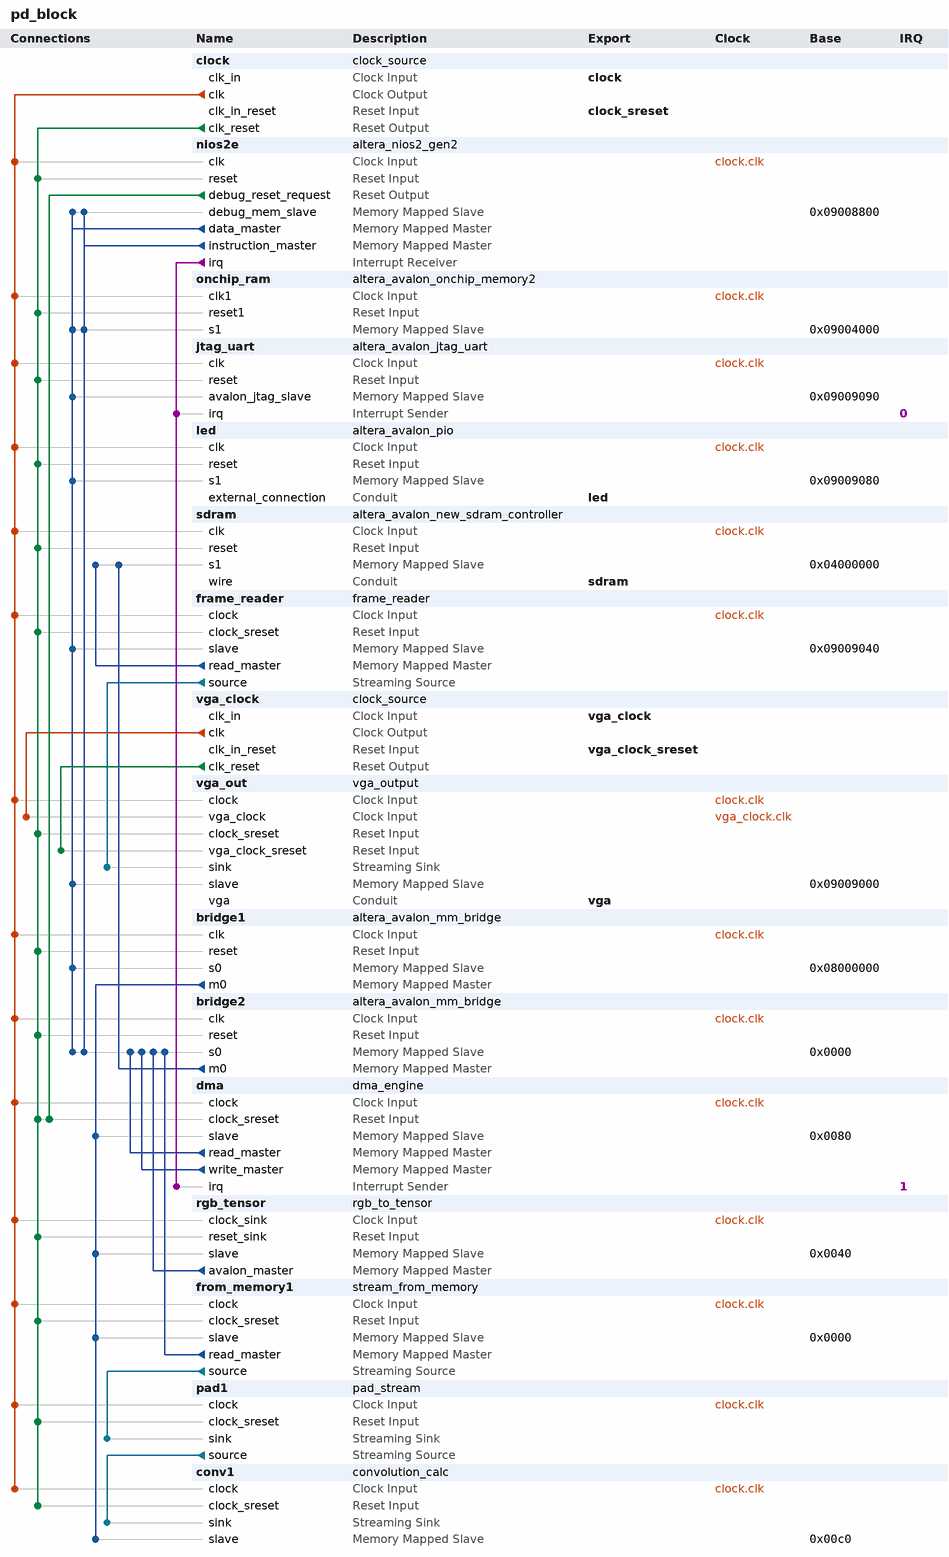
[diagram p0: system contents]
# Platform Designer (Qsys) system pd_block, MAX 10 10M50DAF484C7G
# Parameters at their usual value, and those the tool derives, are not listed.
package require -exact qsys 18.1
create_system pd_block
set_project_property DEVICE_FAMILY {MAX 10}
set_project_property DEVICE 10M50DAF484C7G

add_instance clock clock_source 18.1
set_instance_parameter_value clock clockFrequency 100000000
set_instance_parameter_value clock resetSynchronousEdges BOTH

add_instance nios2e altera_nios2_gen2 18.1
set_instance_parameter_value nios2e dcache_size 2048
set_instance_parameter_value nios2e exceptionSlave onchip_ram.s1
set_instance_parameter_value nios2e icache_size 4096
set_instance_parameter_value nios2e impl Tiny
set_instance_parameter_value nios2e resetSlave onchip_ram.s1

add_instance onchip_ram altera_avalon_onchip_memory2 18.1
set_instance_parameter_value onchip_ram dataWidth 32
set_instance_parameter_value onchip_ram dualPort false
set_instance_parameter_value onchip_ram initMemContent true
set_instance_parameter_value onchip_ram initializationFileName onchip_mem.hex
set_instance_parameter_value onchip_ram memorySize 16384

add_instance jtag_uart altera_avalon_jtag_uart 18.1
set_instance_parameter_value jtag_uart simInteractiveOptions NO_INTERACTIVE_WINDOWS

add_instance led altera_avalon_pio 18.1
set_instance_parameter_value led direction Output
set_instance_parameter_value led width 10

add_instance sdram altera_avalon_new_sdram_controller 18.1
set_instance_parameter_value sdram TAC 5.5
set_instance_parameter_value sdram TRCD 20.0
set_instance_parameter_value sdram TRP 20.0
set_instance_parameter_value sdram casLatency 2
set_instance_parameter_value sdram columnWidth 10
set_instance_parameter_value sdram dataWidth 16
set_instance_parameter_value sdram generateSimulationModel false
set_instance_parameter_value sdram model single_Micron_MT48LC4M32B2_7_chip
set_instance_parameter_value sdram numberOfBanks 4
set_instance_parameter_value sdram numberOfChipSelects 1
set_instance_parameter_value sdram powerUpDelay 100.0
set_instance_parameter_value sdram refreshPeriod 7.8125
set_instance_parameter_value sdram rowWidth 13

add_instance frame_reader frame_reader 1.0
set_instance_parameter_value frame_reader XRES 640
set_instance_parameter_value frame_reader YRES 480

add_instance vga_clock clock_source 18.1
set_instance_parameter_value vga_clock clockFrequency 25000000
set_instance_parameter_value vga_clock resetSynchronousEdges BOTH

add_instance vga_out vga_output 1.0
set_instance_parameter_value vga_out FIFO_DEPTH 1024
set_instance_parameter_value vga_out NO_SIGNAL_RGB 65280
set_instance_parameter_value vga_out VGA_HBPORCH 48
set_instance_parameter_value vga_out VGA_HFPORCH 16
set_instance_parameter_value vga_out VGA_HSYNC 96
set_instance_parameter_value vga_out VGA_VBPORCH 33
set_instance_parameter_value vga_out VGA_VFPORCH 10
set_instance_parameter_value vga_out VGA_VSYNC 2
set_instance_parameter_value vga_out VGA_XRES 640
set_instance_parameter_value vga_out VGA_YRES 480
set_instance_parameter_value vga_out WIDTH 16

add_instance bridge1 altera_avalon_mm_bridge 18.1
set_instance_parameter_value bridge1 ADDRESS_UNITS SYMBOLS
set_instance_parameter_value bridge1 ADDRESS_WIDTH 10
set_instance_parameter_value bridge1 DATA_WIDTH 32
set_instance_parameter_value bridge1 MAX_BURST_SIZE 16
set_instance_parameter_value bridge1 MAX_PENDING_RESPONSES 4
set_instance_parameter_value bridge1 USE_AUTO_ADDRESS_WIDTH 1

add_instance bridge2 altera_avalon_mm_bridge 18.1
set_instance_parameter_value bridge2 ADDRESS_UNITS SYMBOLS
set_instance_parameter_value bridge2 ADDRESS_WIDTH 10
set_instance_parameter_value bridge2 DATA_WIDTH 16
set_instance_parameter_value bridge2 MAX_BURST_SIZE 32
set_instance_parameter_value bridge2 MAX_PENDING_RESPONSES 4
set_instance_parameter_value bridge2 USE_AUTO_ADDRESS_WIDTH 1

add_instance dma dma_engine 1.0

add_instance rgb_tensor rgb_to_tensor 1.0

add_instance from_memory1 stream_from_memory 1.0

add_instance pad1 pad_stream 1.0
set_instance_parameter_value pad1 PAD 1

add_instance conv1 convolution_calc 1.0
set_instance_parameter_value conv1 ADD_LCYCLES 4
set_instance_parameter_value conv1 EXP 8
set_instance_parameter_value conv1 KX 3
set_instance_parameter_value conv1 KY 3
set_instance_parameter_value conv1 MANT 7
set_instance_parameter_value conv1 MLT_LCYCLES 1
set_instance_parameter_value conv1 XRES 64

# connections
add_connection clock.clk bridge1.clk clock
add_connection clock.clk bridge2.clk clock
add_connection clock.clk conv1.clock clock
add_connection clock.clk dma.clock clock
add_connection clock.clk frame_reader.clock clock
add_connection clock.clk from_memory1.clock clock
add_connection clock.clk jtag_uart.clk clock
add_connection clock.clk led.clk clock
add_connection clock.clk nios2e.clk clock
add_connection clock.clk onchip_ram.clk1 clock
add_connection clock.clk pad1.clock clock
add_connection clock.clk rgb_tensor.clock_sink clock
add_connection clock.clk sdram.clk clock
add_connection clock.clk vga_out.clock clock
add_connection vga_clock.clk vga_out.vga_clock clock
add_connection clock.clk_reset bridge1.reset reset
add_connection clock.clk_reset bridge2.reset reset
add_connection clock.clk_reset conv1.clock_sreset reset
add_connection clock.clk_reset dma.clock_sreset reset
add_connection clock.clk_reset frame_reader.clock_sreset reset
add_connection clock.clk_reset from_memory1.clock_sreset reset
add_connection clock.clk_reset jtag_uart.reset reset
add_connection clock.clk_reset led.reset reset
add_connection clock.clk_reset nios2e.reset reset
add_connection clock.clk_reset onchip_ram.reset1 reset
add_connection clock.clk_reset pad1.clock_sreset reset
add_connection clock.clk_reset rgb_tensor.reset_sink reset
add_connection clock.clk_reset sdram.reset reset
add_connection clock.clk_reset vga_out.clock_sreset reset
add_connection nios2e.debug_reset_request dma.clock_sreset reset
add_connection vga_clock.clk_reset vga_out.vga_clock_sreset reset
add_connection bridge1.m0 conv1.slave avalon
set_connection_parameter_value bridge1.m0/conv1.slave baseAddress 0x00c0
add_connection bridge1.m0 dma.slave avalon
set_connection_parameter_value bridge1.m0/dma.slave baseAddress 0x0080
add_connection bridge1.m0 from_memory1.slave avalon
set_connection_parameter_value bridge1.m0/from_memory1.slave baseAddress 0x0000
add_connection bridge1.m0 rgb_tensor.slave avalon
set_connection_parameter_value bridge1.m0/rgb_tensor.slave baseAddress 0x0040
add_connection bridge2.m0 sdram.s1 avalon
set_connection_parameter_value bridge2.m0/sdram.s1 baseAddress 0x04000000
add_connection dma.read_master bridge2.s0 avalon
set_connection_parameter_value dma.read_master/bridge2.s0 baseAddress 0x0000
add_connection dma.write_master bridge2.s0 avalon
set_connection_parameter_value dma.write_master/bridge2.s0 baseAddress 0x0000
add_connection frame_reader.read_master sdram.s1 avalon
set_connection_parameter_value frame_reader.read_master/sdram.s1 arbitrationPriority 64
set_connection_parameter_value frame_reader.read_master/sdram.s1 baseAddress 0x04000000
add_connection from_memory1.read_master bridge2.s0 avalon
set_connection_parameter_value from_memory1.read_master/bridge2.s0 baseAddress 0x0000
add_connection nios2e.data_master bridge1.s0 avalon
set_connection_parameter_value nios2e.data_master/bridge1.s0 baseAddress 0x08000000
add_connection nios2e.data_master bridge2.s0 avalon
set_connection_parameter_value nios2e.data_master/bridge2.s0 baseAddress 0x0000
add_connection nios2e.data_master frame_reader.slave avalon
set_connection_parameter_value nios2e.data_master/frame_reader.slave baseAddress 0x09009040
add_connection nios2e.data_master jtag_uart.avalon_jtag_slave avalon
set_connection_parameter_value nios2e.data_master/jtag_uart.avalon_jtag_slave baseAddress 0x09009090
add_connection nios2e.data_master led.s1 avalon
set_connection_parameter_value nios2e.data_master/led.s1 baseAddress 0x09009080
add_connection nios2e.data_master nios2e.debug_mem_slave avalon
set_connection_parameter_value nios2e.data_master/nios2e.debug_mem_slave baseAddress 0x09008800
add_connection nios2e.data_master onchip_ram.s1 avalon
set_connection_parameter_value nios2e.data_master/onchip_ram.s1 baseAddress 0x09004000
add_connection nios2e.data_master vga_out.slave avalon
set_connection_parameter_value nios2e.data_master/vga_out.slave baseAddress 0x09009000
add_connection nios2e.instruction_master bridge2.s0 avalon
set_connection_parameter_value nios2e.instruction_master/bridge2.s0 baseAddress 0x0000
add_connection nios2e.instruction_master nios2e.debug_mem_slave avalon
set_connection_parameter_value nios2e.instruction_master/nios2e.debug_mem_slave baseAddress 0x09008800
add_connection nios2e.instruction_master onchip_ram.s1 avalon
set_connection_parameter_value nios2e.instruction_master/onchip_ram.s1 baseAddress 0x09004000
add_connection rgb_tensor.avalon_master bridge2.s0 avalon
set_connection_parameter_value rgb_tensor.avalon_master/bridge2.s0 baseAddress 0x0000
add_connection frame_reader.source vga_out.sink avalon_streaming
add_connection from_memory1.source pad1.sink avalon_streaming
add_connection pad1.source conv1.sink avalon_streaming
add_connection nios2e.irq dma.irq interrupt
set_connection_parameter_value nios2e.irq/dma.irq irqNumber 1
add_connection nios2e.irq jtag_uart.irq interrupt
set_connection_parameter_value nios2e.irq/jtag_uart.irq irqNumber 0

# exported interfaces
add_interface clock clock sink
set_interface_property clock EXPORT_OF clock.clk_in
add_interface clock_sreset reset sink
set_interface_property clock_sreset EXPORT_OF clock.clk_in_reset
add_interface led conduit end
set_interface_property led EXPORT_OF led.external_connection
add_interface sdram conduit end
set_interface_property sdram EXPORT_OF sdram.wire
add_interface vga conduit end
set_interface_property vga EXPORT_OF vga_out.vga
add_interface vga_clock clock sink
set_interface_property vga_clock EXPORT_OF vga_clock.clk_in
add_interface vga_clock_sreset reset sink
set_interface_property vga_clock_sreset EXPORT_OF vga_clock.clk_in_reset

set_interconnect_requirement {$system} qsys_mm.clockCrossingAdapter HANDSHAKE
set_interconnect_requirement {$system} qsys_mm.enableEccProtection FALSE
set_interconnect_requirement {$system} qsys_mm.insertDefaultSlave FALSE
set_interconnect_requirement {$system} qsys_mm.maxAdditionalLatency 1

save_system pd_block.qsys
